# Altium schematic sheet webench_design_1160921_77_ad14_sim.SchDoc
size A1; Parameter0: 3m; Parameter1: 0.01; Parameter2: 50u; Parameter3: 10u; Parameter4: node; Parameter5: 50u; Parameter6: 1u; Parameter7: 10n; Parameter8: 50u; Parameter9: 0; Parameter10: 20; Parameter11: 20; Parameter12: off; Parameter13: 0.01; Parameter14: 50u; Parameter15: false; Parameter16: prune; Parameter17: 50u; Parameter18: 1; Parameter19: true; Parameter20: 1000000000; Parameter21: false; Parameter22: 1; Parameter23: isspice_digital; Parameter24: isspice
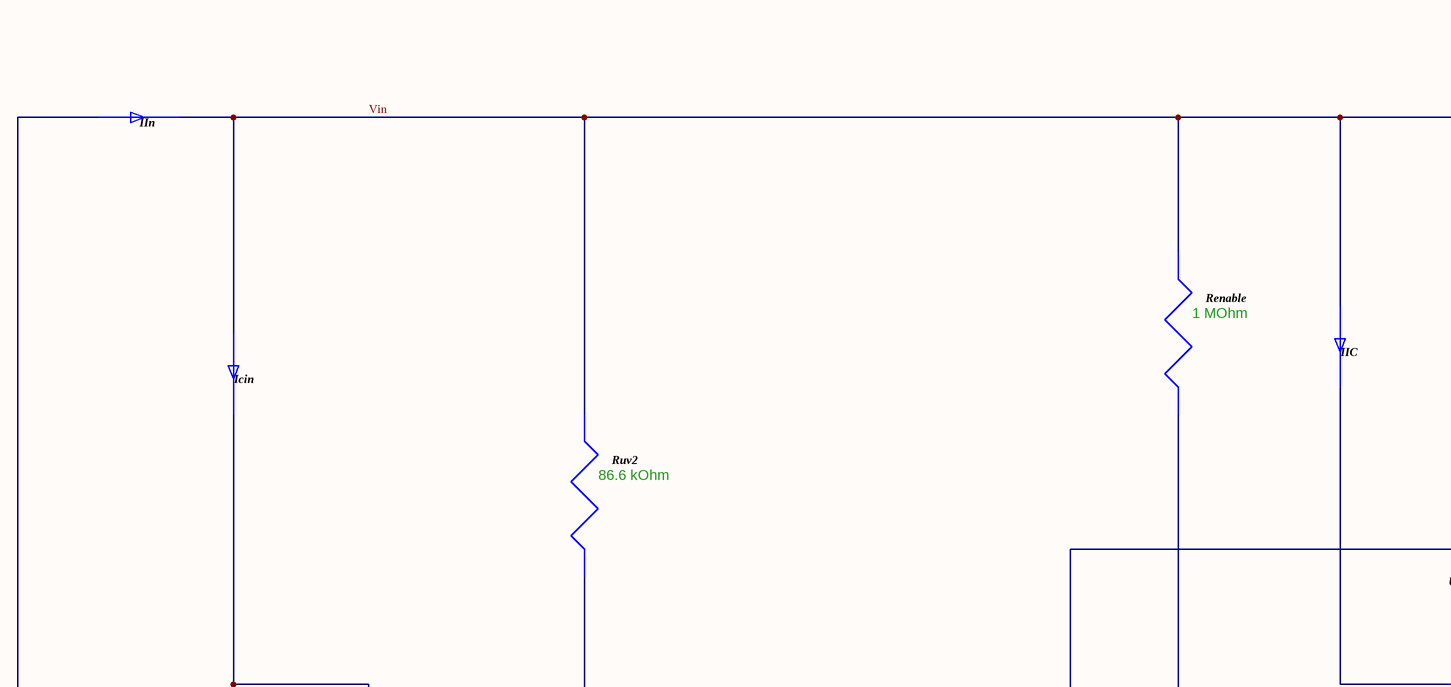
[diagram p0: webench_design_1160921_77_ad14_sim.SchDoc, top left]
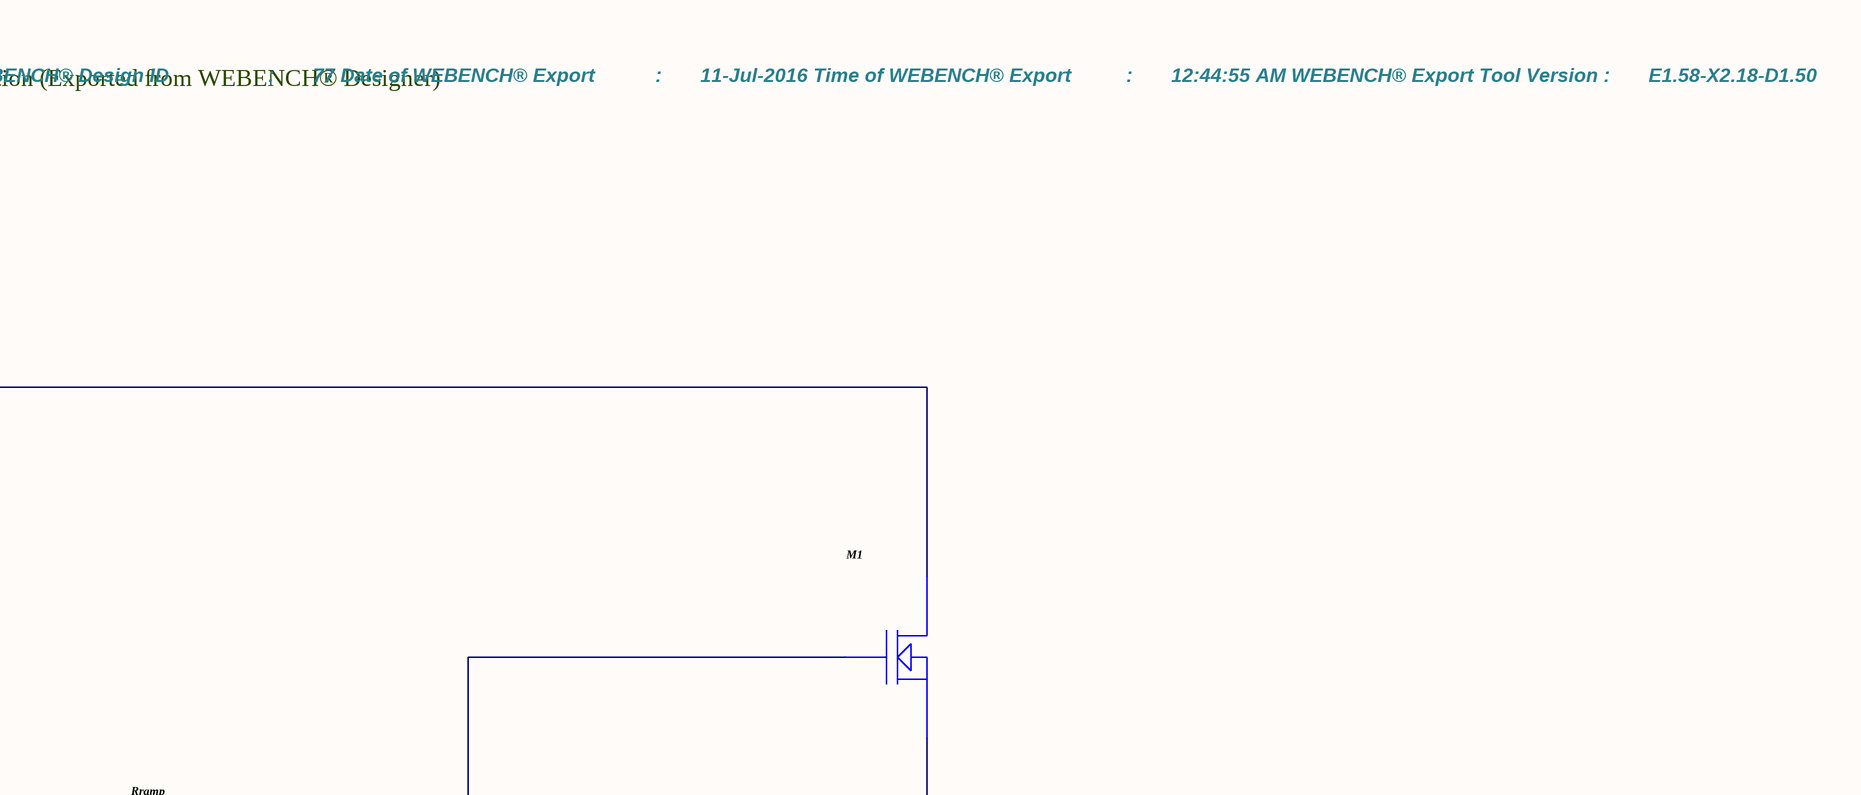
[diagram p1: webench_design_1160921_77_ad14_sim.SchDoc, top right]
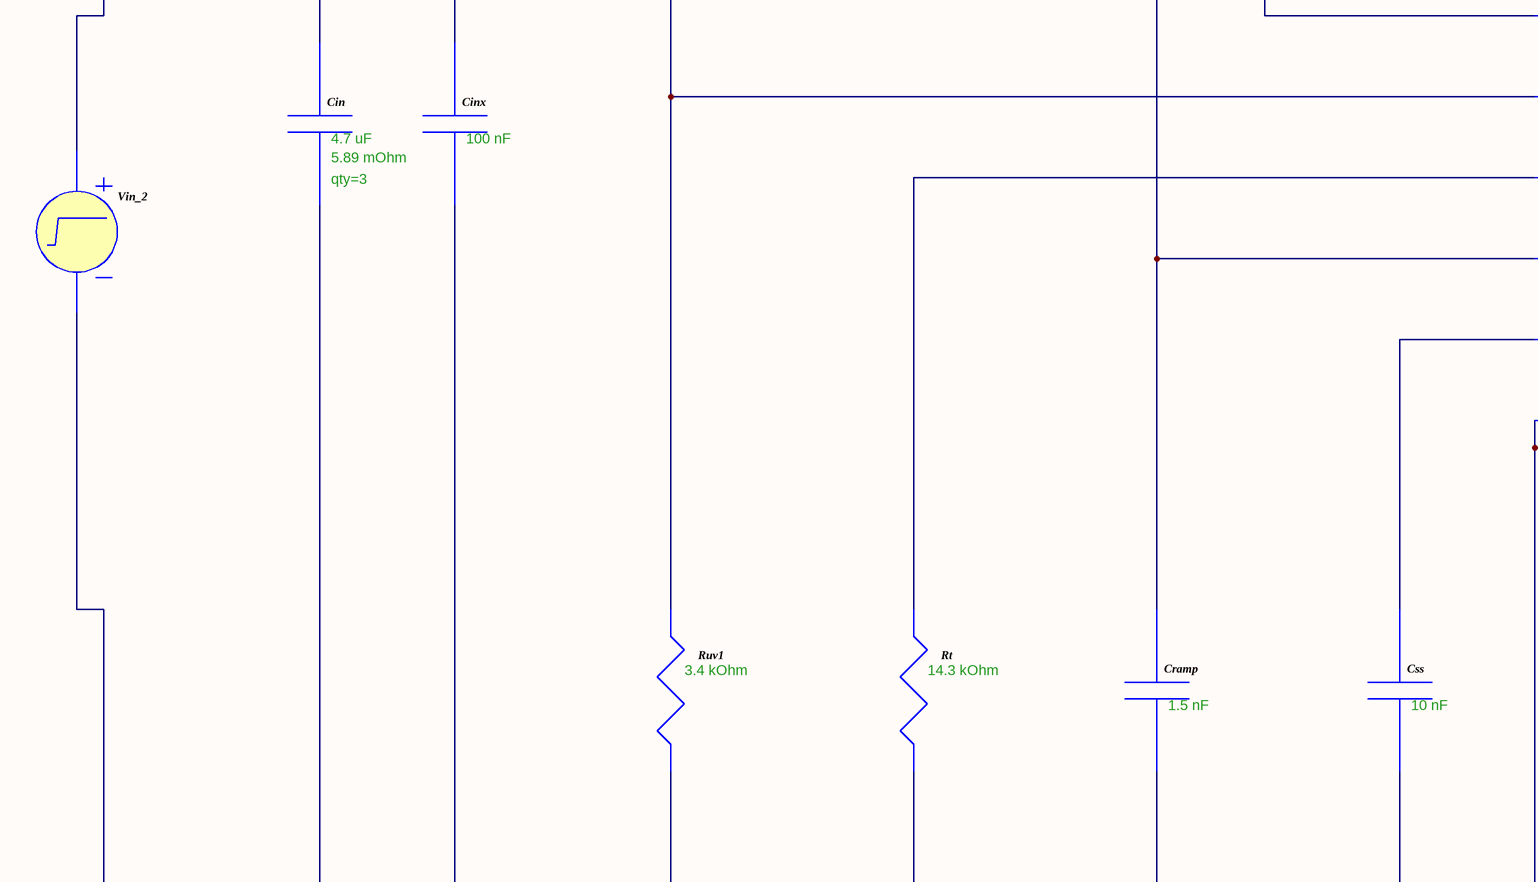
[diagram p2: webench_design_1160921_77_ad14_sim.SchDoc, bottom left]
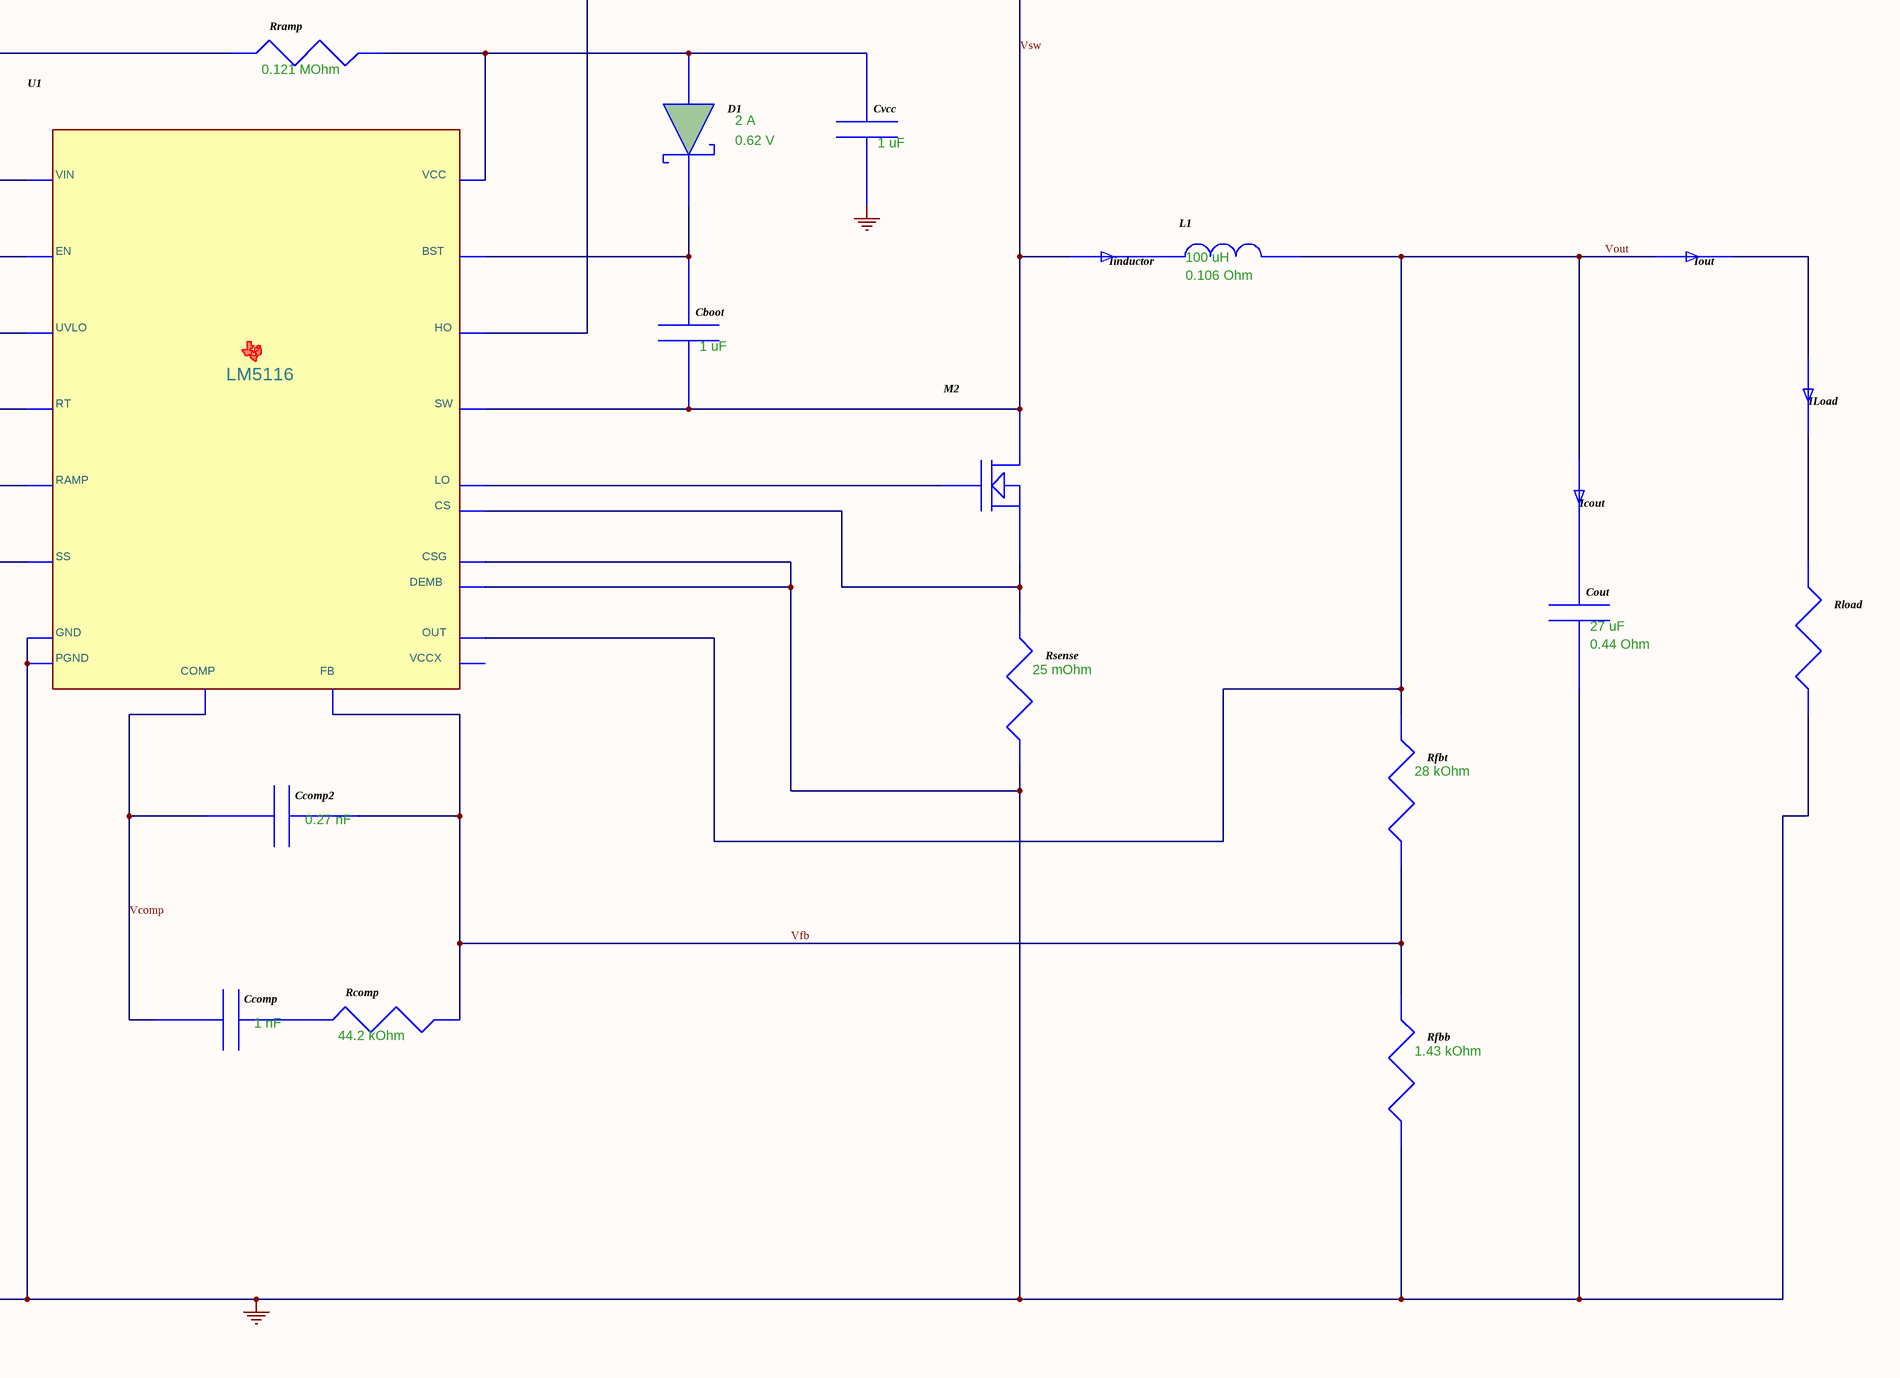
[diagram p3: webench_design_1160921_77_ad14_sim.SchDoc, bottom right]

## Parts
Cboot  (no value)
Ccomp  (no value)
Ccomp2  (no value)
Cin  (no value)
Cinx  (no value)
Cout  (no value)
Cramp  (no value)
Css  (no value)
Cvcc  (no value)
D1  (no value)
Icin  (no value)
Icout  (no value)
IIC  (no value)
IIn  (no value)
Iinductor  (no value)
ILoad  (no value)
Iout  (no value)
L1  (no value)
M1  (no value)
M2  (no value)
Rcomp  (no value)
Renable  (no value)
Rfbb  (no value)
Rfbt  (no value)
Rload  (no value)
Rramp  (no value)
Rsense  (no value)
Rt  (no value)
Ruv1  (no value)
Ruv2  (no value)
U1  (no value)
Vin_2  (no value)

## Nets
GND: Cin.2 Cinx.0 Cout.4 Cramp.0 Css.0 Cvcc.0 Rfbb.0 Rload.2 Rsense.0 Rt.0 Ruv1.0 U1.CSG U1.DEMB U1.GND U1.PGND Vin_2.2
Vcomp: Ccomp.8 Ccomp2.8 U1.COMP
Vfb: Ccomp2.9 Rcomp.9 Rfbb.9 Rfbt.9 U1.FB
Vin: Icin.1 IIC.1 IIn.2 M1.drain Renable.3 Ruv2.3
Vout: Icout.1 Iout.1 L1.2 Rfbt.13 U1.OUT
Vsw: Cboot.14 Iinductor.1 M1.source M2.d1 U1.SW
NetCboot_11: Cboot.11 D1.11 U1.BST
NetCcomp_24: Ccomp.24 Rcomp.24
NetCin_1: Cin.1 Cinx.1 Icin.2
NetCout_2: Cout.2 Icout.2
NetCramp_6: Cramp.6 Rramp.6 U1.RAMP
NetCss_7: Css.7 U1.SS
NetCvcc_10: Cvcc.10 D1.10 Rramp.10 U1.VCC
NetIIC_2: IIC.2 U1.VIN
NetIIn_1: IIn.1 Vin_2.1
NetIinductor_2: Iinductor.2 L1.1
NetILoad_1: ILoad.1 Iout.2
NetILoad_2: ILoad.2 Rload.1
NetM1_gate: M1.gate U1.HO
NetM2_g1: M2.g1 U1.LO
NetM2_s1: M2.s1 Rsense.12 U1.CS
NetRenable_5: Renable.5 U1.EN
NetRt_4: Rt.4 U1.RT
NetRuv1_2: Ruv1.2 Ruv2.2 U1.UVLO

Not connected (* = marked no-connect by the designer): U1 VCCX

## Notes on the sheet
- LM5116 Startup Simulation
  (Exported from WEBENCH® Designer)
- Title :    LM5116MHX/NOPB 40.0V-80.0V to 25.00V @
  2.0A
  -------------------------------------------------------------------------
  WEBENCH® User ID                      :       1160921
  WEBENCH® Design ID                  :       77
  Date of WEBENCH® Export           :       11-Jul-2016
  Time of WEBENCH® Export          :       12:44:55 AM
  WEBENCH® Export Tool Version :       E1.58-X2.18-D1.50
- (near IIn) IIn
- (near Renable) Renable
- (near M1) M1
- (near IIC) IIC
- (near Icin) Icin
- (near Ruv2) Ruv2
- (near Rramp) Rramp
- U1
- (near D1) D1
- (near Cvcc) Cvcc
- Iinductor
- L1
- (near Iout) Iout
- (near Cboot) Cboot
- (near Cin) Cin
- (near Cinx) Cinx
- (near M2) M2
- (near Vin_2) Vin_2
- (near ILoad) ILoad
- (near Icout) Icout
- (near Cout) Cout
- (near Rload) Rload
- (near Rsense) Rsense
- (near Rfbt) Rfbt
- (near Ccomp2) Ccomp2
- (near Ruv1) Ruv1
- (near Rt) Rt
- (near Cramp) Cramp
- (near Css) Css
- (near Ccomp) Ccomp
- (near Rcomp) Rcomp
- (near Rfbb) Rfbb
- (in symbol Cboot) 1 uF
- (in symbol Ccomp) 1 nF
- (in symbol Ccomp2) 0.27 nF
- (in symbol Cin) 4.7 uF; 5.89 mOhm; qty=3
- (in symbol Cinx) 100 nF
- (in symbol Cout) 27 uF; 0.44 Ohm
- (in symbol Cramp) 1.5 nF
- (in symbol Css) 10 nF
- (in symbol Cvcc) 1 uF
- (in symbol D1) 2 A; 0.62 V
- (in symbol L1) 100 uH; 0.106 Ohm
- (in symbol Rcomp) 44.2 kOhm
- (in symbol Renable) 1 MOhm
- (in symbol Rfbb) 1.43 kOhm
- (in symbol Rfbt) 28 kOhm
- (in symbol Rramp) 0.121 MOhm
- (in symbol Rsense) 25 mOhm
- (in symbol Rt) 14.3 kOhm
- (in symbol Ruv1) 3.4 kOhm
- (in symbol Ruv2) 86.6 kOhm
- (in symbol U1) LM5116

## Library data of the parts
Cboot = Cboot
Ccomp = Ccomp
Ccomp2 = Ccomp2
Cin = Cin
Cinx = Cinx
Cout = Cout
Cramp = Cramp
Css = Css
Cvcc = Cvcc
D1 = D1
Icin = Icin: Parameter0: *********************************** / *     Created by WB Importer      * / *********************************** / .SUBCKT Icin 1 2 / V_Iprobe 1 2 0.0 / .ENDS; VALUE: 0
Icout = Icout: Parameter0: *********************************** / *     Created by WB Importer      * / *********************************** / .SUBCKT Icout 1 2 / V_Iprobe 1 2 0.0 / .ENDS; VALUE: 0
IIC = IIC: Parameter0: *********************************** / *     Created by WB Importer      * / *********************************** / .SUBCKT IIC 1 2 / V_Iprobe 1 2 0.0 / .ENDS; VALUE: 0
IIn = IIn: Parameter0: *********************************** / *     Created by WB Importer      * / *********************************** / .SUBCKT IIn 1 2 / V_Iprobe 1 2 0.0 / .ENDS; VALUE: 0
Iinductor = Iinductor: Parameter0: *********************************** / *     Created by WB Importer      * / *********************************** / .SUBCKT Iinductor 1 2 / V_Iprobe 1 2 0.0 / .ENDS; VALUE: 0
ILoad = ILoad: Parameter0: *********************************** / *     Created by WB Importer      * / *********************************** / .SUBCKT ILoad 1 2 / V_Iprobe 1 2 0.0 / .ENDS; VALUE: 0
Iout = Iout: Parameter0: *********************************** / *     Created by WB Importer      * / *********************************** / .SUBCKT Iout 1 2 / V_Iprobe 1 2 0.0 / .ENDS; VALUE: 0
L1 = L1
M1 = M1
M2 = M2
Rcomp = Rcomp
Renable = Renable
Rfbb = Rfbb
Rfbt = Rfbt
Rload = Rload
Rramp = Rramp
Rsense = Rsense
Rt = Rt
Ruv1 = Ruv1
Ruv2 = Ruv2
U1 = U1
Vin_2 = Vin_2